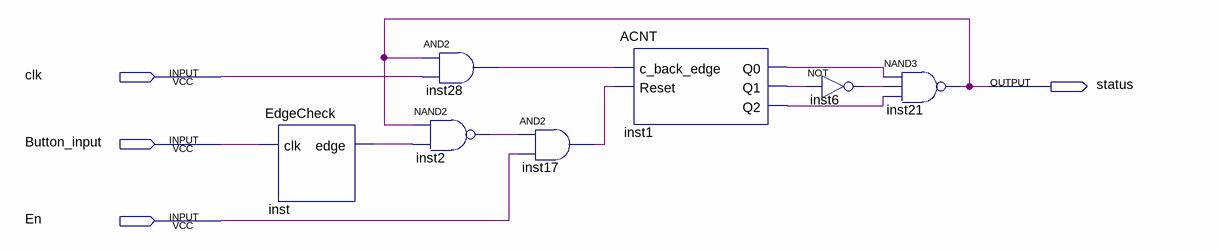
[diagram p0: schematic sheet]
// Quartus schematic Timer.bdf as structural Verilog: 7 symbols, 4 pins
module Timer (
  input  clk,
  input  Button_input,
  input  En,
  output status
);

  wire inst1_q0, inst1_q1, inst1_q2, inst2_out, inst6_out, inst17_out, inst28_out, inst_edge;

  EdgeCheck inst (.clk(Button_input), .\edge (inst_edge));
  and inst28 (inst28_out, status, clk);
  nand inst2 (inst2_out, status, inst_edge);
  and inst17 (inst17_out, inst2_out, En);
  ACNT inst1 (.c_back_edge(inst28_out), .Reset(inst17_out), .Q0(inst1_q0), .Q1(inst1_q1), .Q2(inst1_q2));
  not inst6 (inst6_out, inst1_q1);
  nand inst21 (status, inst1_q0, inst6_out, inst1_q2);
endmodule
